# Altium schematic sheet CC_BY_3.0_License.SchDoc: Creative Commons Attribution 3.0 License
size B; DrawnBy: AHonecker; Organization: AH Design; Address1: Designed and; Address2: Produced in NY; Address3: USA; DocumentNumber: 2; Revision: 1; SheetNumber: 2; SheetTotal: 2
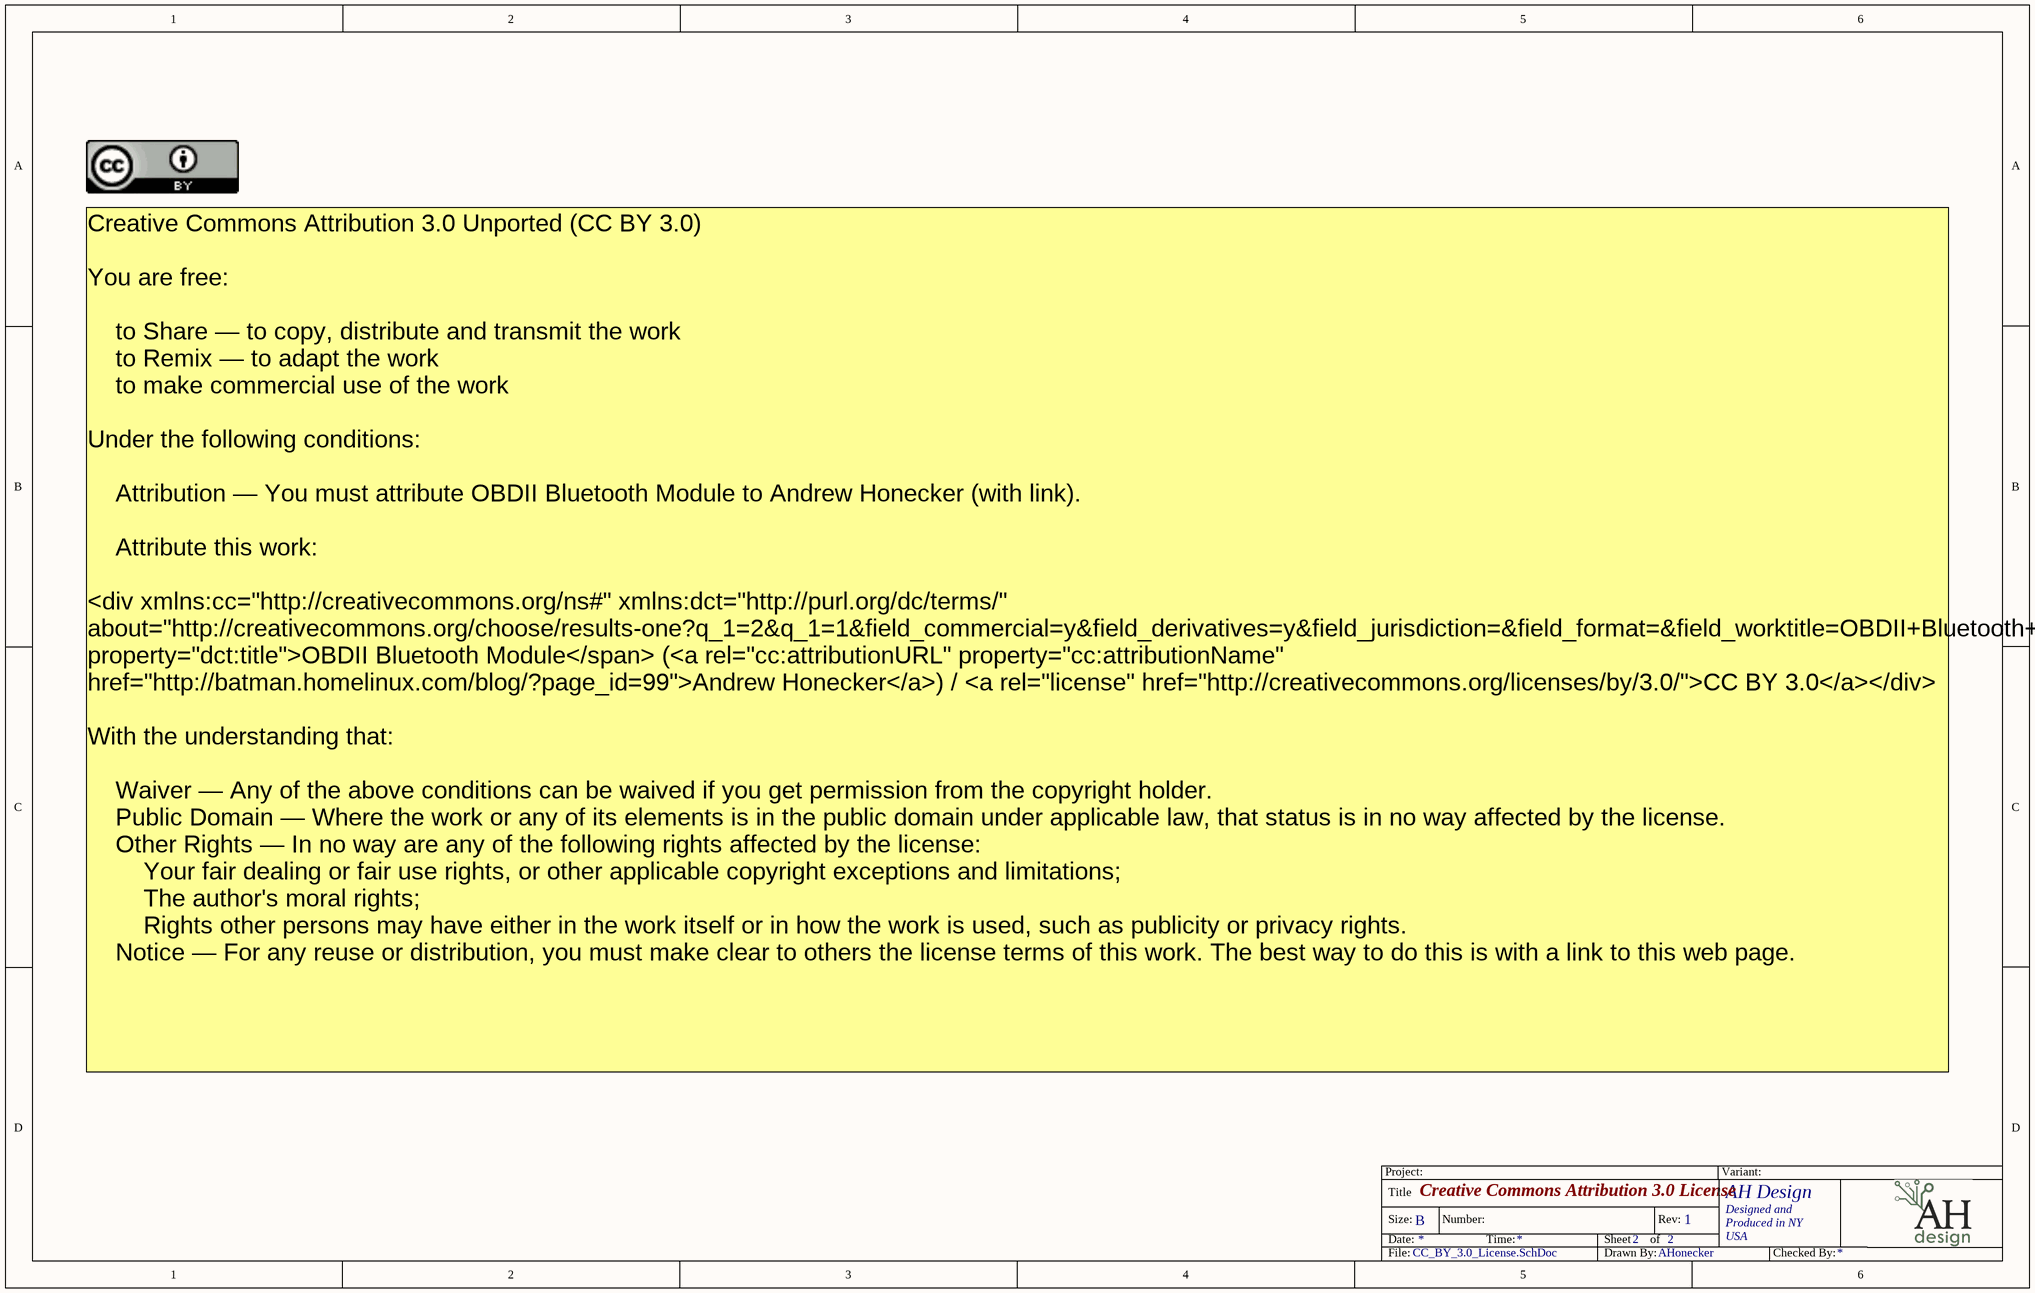
[diagram p0: CC_BY_3.0_License.SchDoc]

## Notes on the sheet
- Creative Commons Attribution 3.0 Unported (CC BY 3.0)
  You are free:
  to Share — to copy, distribute and transmit the work
  to Remix — to adapt the work
  to make commercial use of the work
  Under the following conditions:
  Attribution — You must attribute OBDII Bluetooth Module to Andrew Honecker (with link).
  Attribute this work:
  <div xmlns:cc="http://creativecommons.org/ns#" xmlns:dct="http://purl.org/dc/terms/" about="http://creativecommons.org/choose/results-one?q_1=2&q_1=1&field_commercial=y&field_derivatives=y&field_jurisdiction=&field_format=&field_worktitle=OBDII+Bluetooth+Module&field_attribute_to_name=Andrew+Honecker&field_attribute_to_url=http%3A%2F%2Fbatman.homelinux.com%2Fblog%2F%3Fpage_id%3D99&field_sourceurl=&field_morepermissionsurl=&lang=en_US&n_questions=3"><span property="dct:title">OBDII Bluetooth Module</span> (<a rel="cc:attributionURL" property="cc:attributionName" href="http://batman.homelinux.com/blog/?page_id=99">Andrew Honecker</a>) / <a rel="license" href="http://creativecommons.org/licenses/by/3.0/">CC BY 3.0</a></div>
  With the understanding that:
  Waiver — Any of the above conditions can be waived if you get permission from the copyright holder.
  Public Domain — Where the work or any of its elements is in the public domain under applicable law, that status is in no way affected by the license.
  Other Rights — In no way are any of the following rights affected by the license:
  Your fair dealing or fair use rights, or other applicable copyright exceptions and limitations;
  The author's moral rights;
  Rights other persons may have either in the work itself or in how the work is used, such as publicity or privacy rights.
  Notice — For any reuse or distribution, you must make clear to others the license terms of this work. The best way to do this is with a link to this web page.
- Project:
- Variant:
- Title
- Size:
- Date:
- B
- Number:
- Time:
- Sheet
- of
- Rev:
- File:
- Drawn By:
- Checked By: